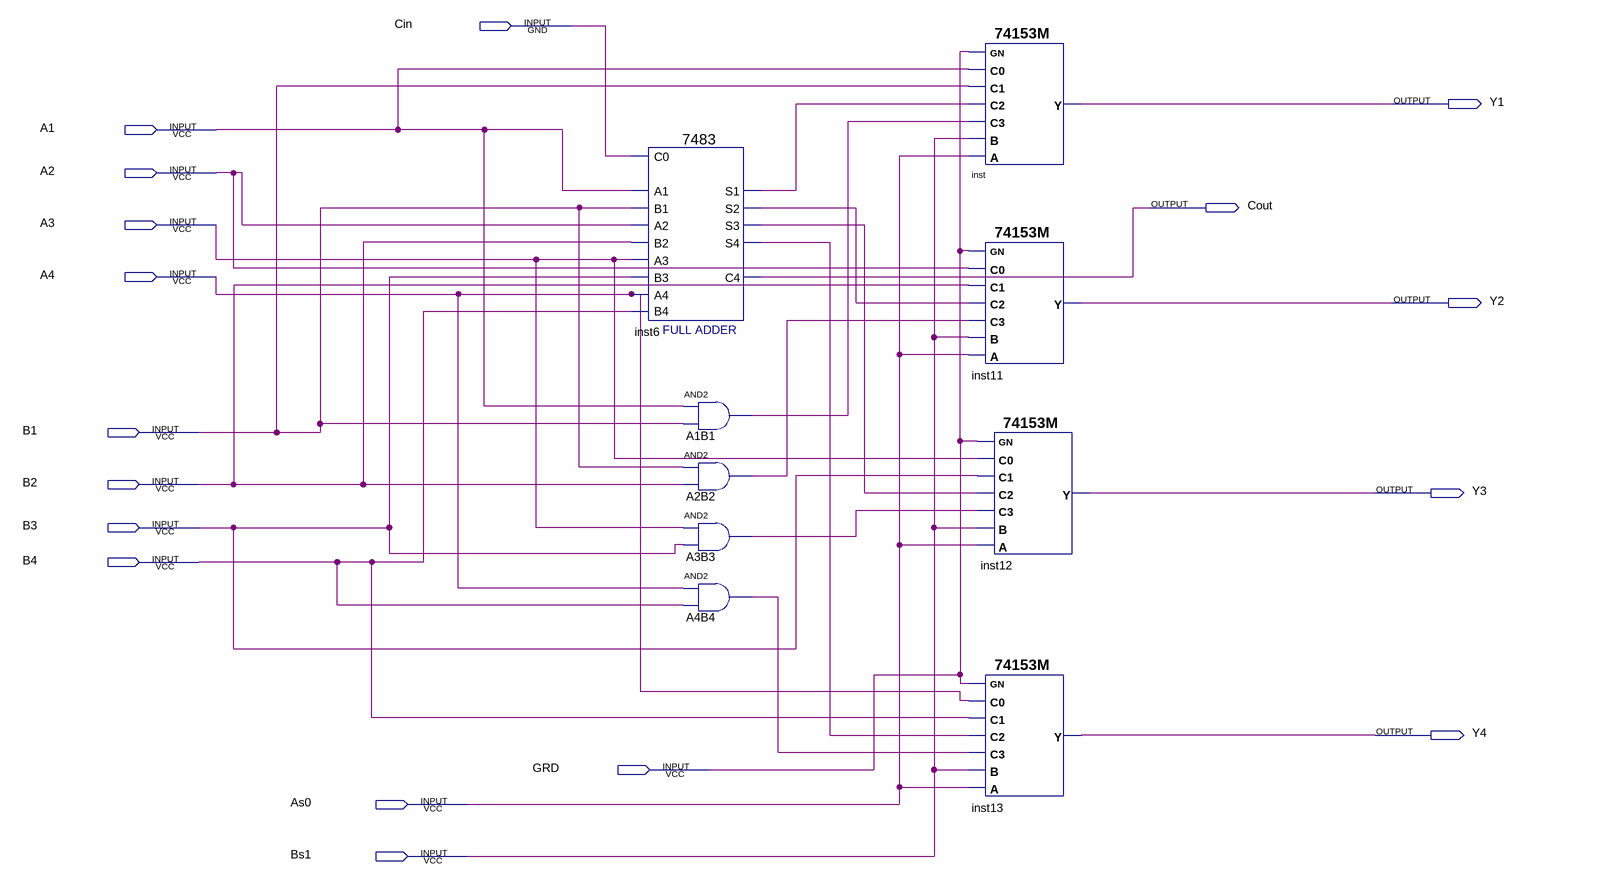
[diagram p0: schematic sheet]
// Quartus schematic fullAdder.bdf as structural Verilog: 9 symbols, 17 pins
module fullAdder (
  input  Cin,
  input  A1,
  input  A2,
  input  A3,
  input  A4,
  input  B1,
  input  B2,
  input  B3,
  input  B4,
  input  GRD,
  input  As0,
  input  Bs1,
  output Y1,
  output Cout,
  output Y2,
  output Y3,
  output Y4
);

  wire A1B1_out, A2B2_out, A3B3_out, A4B4_out, inst6_s1, inst6_s2, inst6_s3, inst6_s4;

  \7483  inst6 (
    .B4(B4), .C0(Cin), .A1(A1), .A2(A2), .B1(B1), .B2(B2), .A3(A3), .B3(B3), .A4(A4), .S3(inst6_s3),
    .S4(inst6_s4), .S2(inst6_s2), .C4(Cout), .S1(inst6_s1));
  and A1B1 (A1B1_out, A1, B1);
  and A2B2 (A2B2_out, B1, B2);
  and A3B3 (A3B3_out, A3, B3);
  and A4B4 (A4B4_out, A4, B4);
  \74153M  inst (.A(As0), .B(Bs1), .C3(A1B1_out), .C2(inst6_s1), .C1(B1), .C0(A1), .GN(GRD), .Y(Y1));
  \74153M  inst11 (.A(As0), .B(Bs1), .C3(A2B2_out), .C2(inst6_s2), .C1(B2), .C0(A2), .GN(GRD), .Y(Y2));
  \74153M  inst12 (.A(As0), .B(Bs1), .C3(A3B3_out), .C2(inst6_s3), .C1(B3), .C0(A3), .GN(GRD), .Y(Y3));
  \74153M  inst13 (.A(As0), .B(Bs1), .C3(A4B4_out), .C2(inst6_s4), .C1(B4), .C0(A4), .GN(GRD), .Y(Y4));
endmodule
